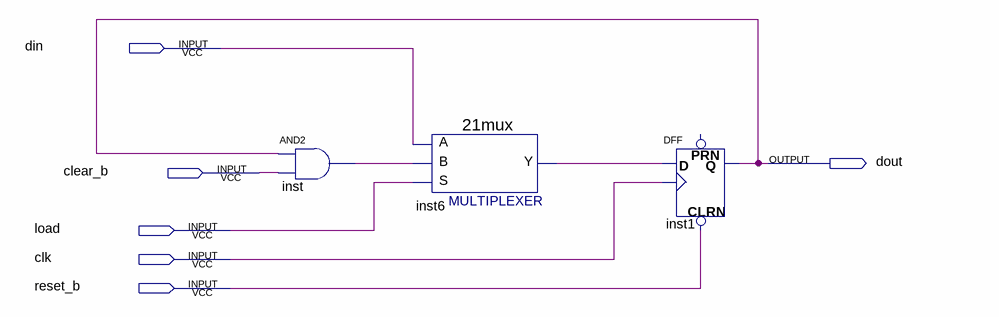
[diagram p0: schematic sheet]
// Quartus schematic reg1bit.bdf as structural Verilog: 3 symbols, 6 pins
module reg1bit (
  input  din,
  input  clear_b,
  input  load,
  input  clk,
  input  reset_b,
  output dout
);

  wire inst6_y, inst_out;

  and inst (inst_out, dout, clear_b);
  \21mux  inst6 (.S(load), .B(inst_out), .A(din), .Y(inst6_y));
  DFF inst1 (.CLRN(reset_b), .CLK(clk), .D(inst6_y), .Q(dout));  // open: PRN
endmodule
